# EAGLE design Payload (EAGLE 9.6.2)

## Sheet 1 of 2
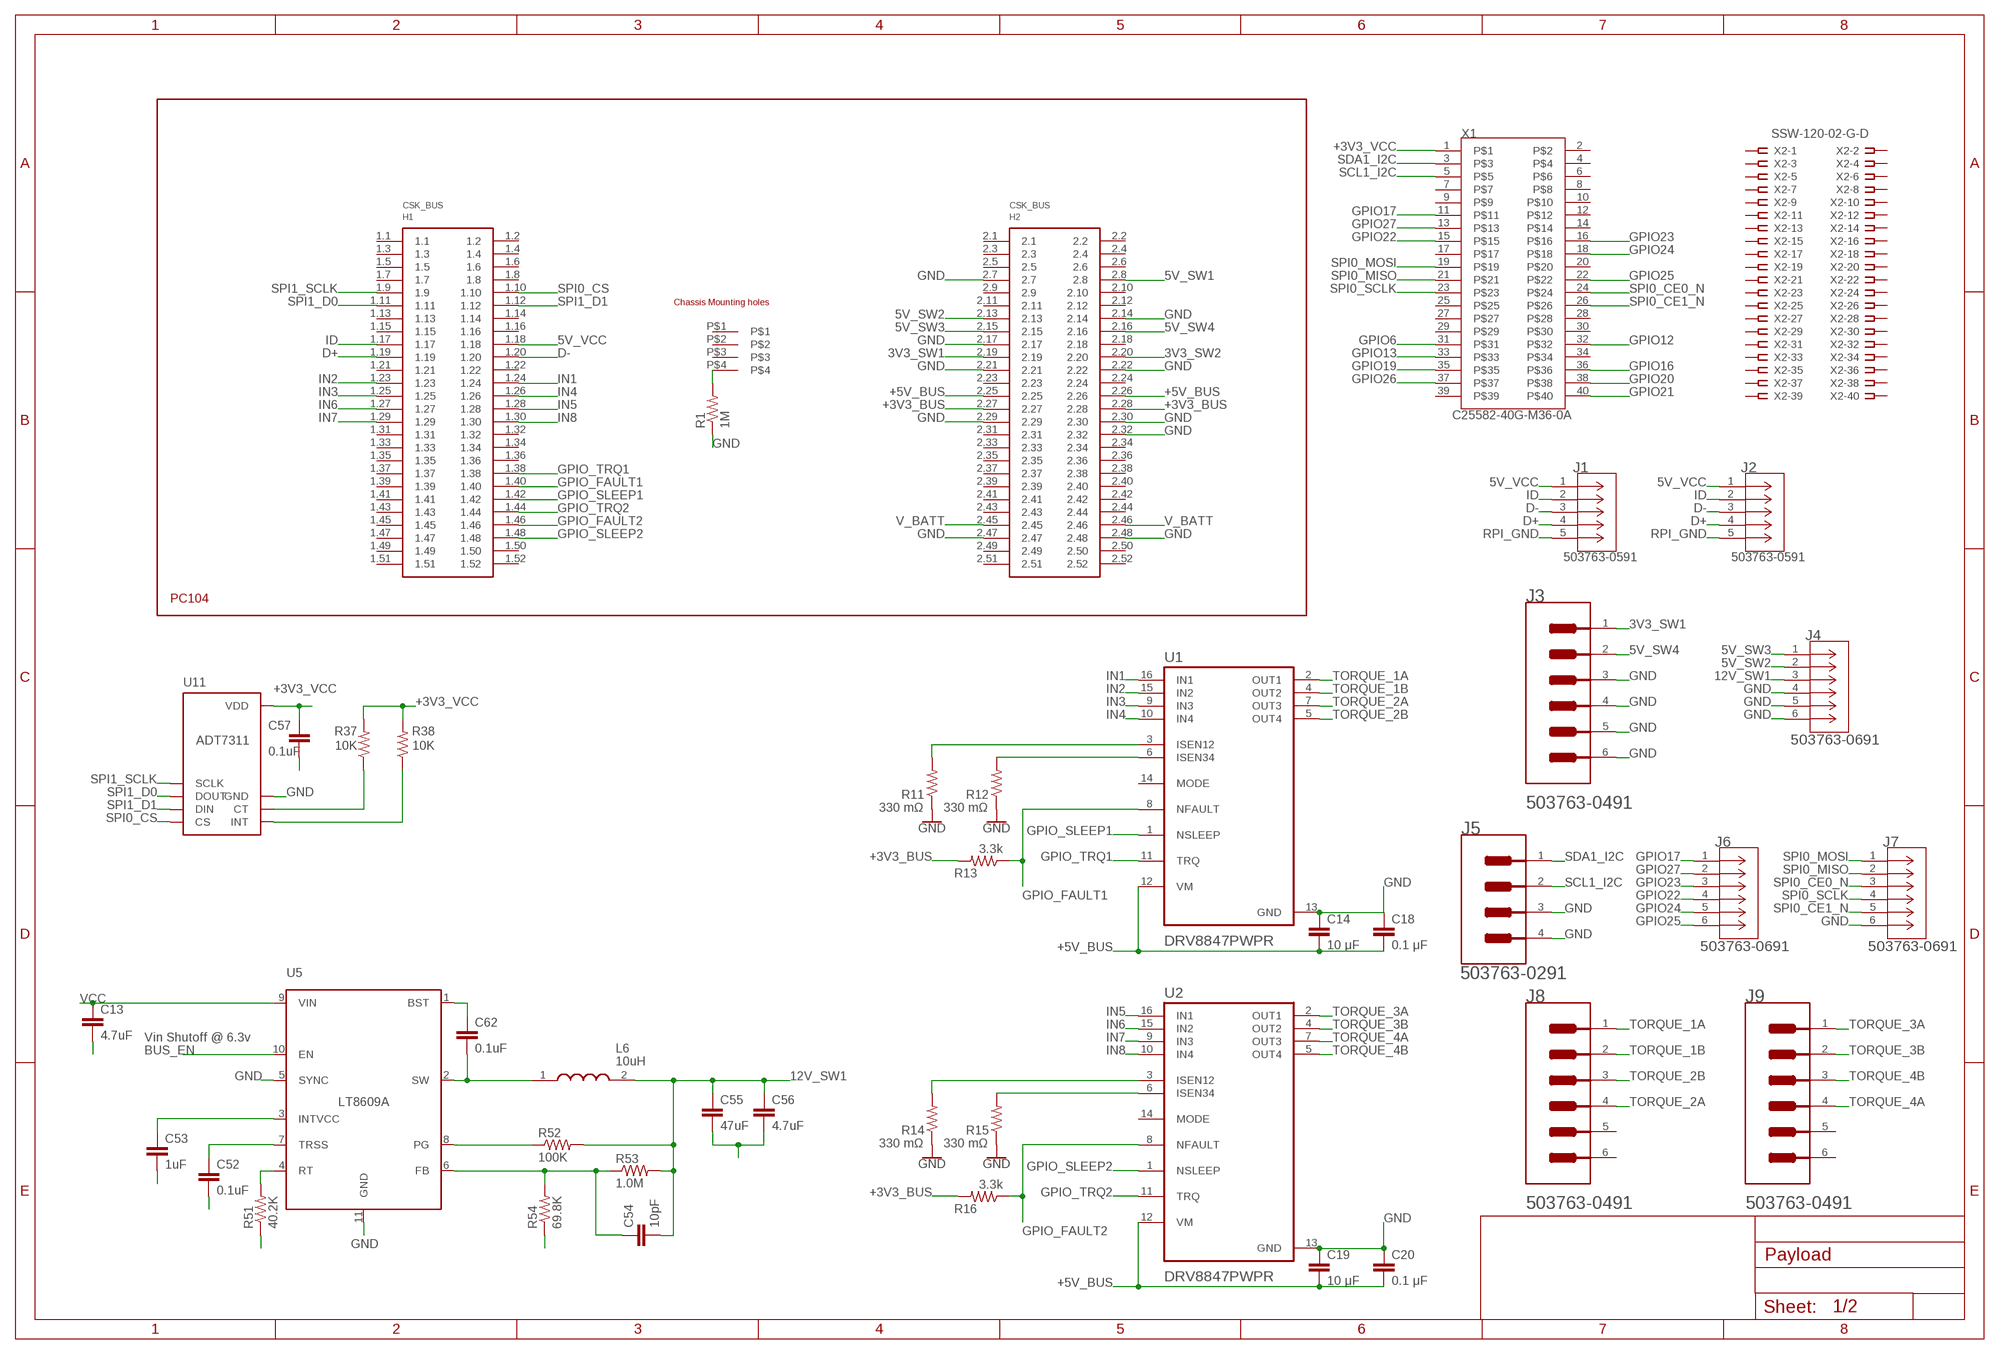
[diagram p0: schematic, sheet 1]

### Parts
C13  4.7uF  CAP0805  [0805]
C14  10 μF  CAP0805  [0805]
C18  0.1 μF  CAP0805  [0805]
C19  10 μF  CAP0805  [0805]
C20  0.1 μF  CAP0805  [0805]
C52  0.1uF  CAP0805  [0805]
C53  1uF  CAP0805  [0805]
C54  10pF  CAP0805  [0805]
C55  47uF  CAP1210  [1210]
C56  4.7uF  CAP0805  [0805]
C57  0.1uF  CAP0805  [0805]
C62  0.1uF  CAP0805  [0805]
H1  PC104_WCONN  [PC104_WCONN]
J1  503763-0591  [CONN_5037630591_MOL]
J2  503763-0591  [CONN_5037630591_MOL]
J3  MOLEX_503763-0491MOLEX_503763-0491_0_0  [MOLEX_503763-0491_0]
J4  503763-0691  [CONN_503763-0691_MOL]
J5  MOLEX_503763-0291MOLEX_503763-0291_0_0  [MOLEX_503763-0291_0]
J6  503763-0691  [CONN_503763-0691_MOL]
J7  503763-0691  [CONN_503763-0691_MOL]
J8  MOLEX_503763-0491MOLEX_503763-0491_0_0  [MOLEX_503763-0491_0]
J9  MOLEX_503763-0491MOLEX_503763-0491_0_0  [MOLEX_503763-0491_0]
L6  10uH  XFL4020-222MEC  [XFL4030472MEB]
R1  1M  RESISTOR0805-RES  [0805]
R11  330 mΩ  RESISTOR0805-RES  [0805]
R12  330 mΩ  RESISTOR0805-RES  [0805]
R13  3.3k  RESISTOR0805-RES  [0805]
R14  330 mΩ  RESISTOR0805-RES  [0805]
R15  330 mΩ  RESISTOR0805-RES  [0805]
R16  3.3k  RESISTOR0805-RES  [0805]
R37  10K  RESISTOR0805-RES  [0805]
R38  10K  RESISTOR0805-RES  [0805]
R51  40.2K  RESISTOR0805-RES  [0805]
R52  100K  RESISTOR0805-RES  [0805]
R53  1.0M  RESISTOR0805-RES  [0805]
R54  69.8K  RESISTOR0805-RES  [0805]
U1  DRV8847PWPR  [SOP65P640X120-17N]
U2  DRV8847PWPR  [SOP65P640X120-17N]
U5  LT8609A  [MSOP-10_MSE]
U11  ADT7311  [SOIC-8]
X1  C25582-40G-M36-0A  [ADAFRUIT_C25582-40G-M36-0A_0]
X2  SSW-120-02-G-D  [SSW-120-02-G-D]

### Nets
3V3_SW1: H1.2.19 J3.1
3V3_SW2: H1.2.20
5V_SW1: H1.2.8
5V_SW2: H1.2.13 J4.2
5V_SW3: H1.2.15 J4.1
5V_SW4: H1.2.16 J3.2
5V_VCC: H1.1.18 J1.1 J2.1
12V_SW1: C54.2 C55.1 C56.1 J4.3 L6.2 R52.2 R53.2
+3V3_BUS: H1.2.27 H1.2.28 R13.2 R16.2
+3V3_VCC: C57.1 R37.2 R38.2 U11.8(VDD) X1.1
+5V_BUS: C14.2 C18.2 C19.2 C20.2 H1.2.25 H1.2.26 U1.12(VM) U2.12(VM)
BST_3V3_BUS: C62.1 U5.1(BST)
BUS_EN: U5.10(EN)
D+: H1.1.19 J1.4 J2.4
D-: H1.1.20 J1.3 J2.3
FB_3V3_BUS: C54.1 R53.1 R54.2 U5.6(FB)
GND: C14.1 C18.1 C19.1 C20.1 C52.2 C53.2 C55.2 C56.2 C57.2 H1.2.7 H1.2.14 H1.2.17 H1.2.21 H1.2.22 H1.2.29 H1.2.30 H1.2.32 H1.2.47 H1.2.48 J3.3 J3.4 J3.5(MNT_1) J3.6(MNT_2) J4.4 J4.5 J4.6 J5.3(MNT_1) J5.4(MNT_2) J7.6 R1.1 R11.1 R12.1 R14.1 R15.1 R51.1 R54.1 U1.13(GND) U2.13(GND) U5.5(SYNC) U5.11(GND) U11.7(GND) ; also sheet 2
GND1: C13.2
GPIO6: X1.31
GPIO12: X1.32
GPIO13: X1.33
GPIO16: X1.36
GPIO17: J6.1 X1.11
GPIO19: X1.35
GPIO20: X1.38
GPIO21: X1.40
GPIO22: J6.4 X1.15
GPIO23: J6.3 X1.16
GPIO24: J6.5 X1.18
GPIO25: J6.6 X1.22
GPIO26: X1.37
GPIO27: J6.2 X1.13
GPIO_FAULT1: H1.1.40 R13.1 U1.8(NFAULT)
GPIO_FAULT2: H1.1.46 R16.1 U2.8(NFAULT)
GPIO_SLEEP1: H1.1.42 U1.1(NSLEEP)
GPIO_SLEEP2: H1.1.48 U2.1(NSLEEP)
GPIO_TRQ1: H1.1.38 U1.11(TRQ)
GPIO_TRQ2: H1.1.44 U2.11(TRQ)
ID: H1.1.17 J1.2 J2.2
IN1: H1.1.24 U1.16(IN1)
IN2: H1.1.23 U1.15(IN2)
IN3: H1.1.25 U1.9(IN3)
IN4: H1.1.26 U1.10(IN4)
IN5: H1.1.28 U2.16(IN1)
IN6: H1.1.27 U2.15(IN2)
IN7: H1.1.29 U2.9(IN3)
IN8: H1.1.30 U2.10(IN4)
N$9: H1.P$4 R1.2
N$16: R12.2 U1.6(ISEN34)
N$18: R11.2 U1.3(ISEN12)
N$20: R15.2 U2.6(ISEN34)
N$21: R14.2 U2.3(ISEN12)
PG_3V3_BUS: R52.1 U5.8(PG)
RPI_GND: J1.5 J2.5
RT_3V3_BUS: R51.2 U5.4(RT)
SCL1_I2C: J5.2 X1.5
SDA1_I2C: J5.1 X1.3
SPI0_CE0_N: J7.3 X1.24
SPI0_CE1_N: J7.5 X1.26
SPI0_CS: H1.1.10 U11.4(CS)
SPI0_MISO: J7.2 X1.21
SPI0_MOSI: J7.1 X1.19
SPI0_SCLK: J7.4 X1.23
SPI1_D0: H1.1.11 U11.2(DOUT)
SPI1_D1: H1.1.12 U11.3(DIN)
SPI1_SCLK: H1.1.9 U11.1(SCLK)
SW_3V3_BUS: C62.2 L6.1 U5.2(SW)
TORQUE_1A: J8.1 U1.2(OUT1)
TORQUE_1B: J8.2 U1.4(OUT2)
TORQUE_2A: J8.4 U1.7(OUT3)
TORQUE_2B: J8.3 U1.5(OUT4)
TORQUE_3A: J9.1 U2.2(OUT1)
TORQUE_3B: J9.2 U2.4(OUT2)
TORQUE_4A: J9.4 U2.7(OUT3)
TORQUE_4B: J9.3 U2.5(OUT4)
TRSS_3V3_BUS: C52.1 U5.7(TRSS)
U11_CT: R37.1 U11.6(CT)
U11_INT: R38.1 U11.5(INT)
V_BATT: H1.2.45 H1.2.46 ; also sheet 2
VCC: C13.1 U5.9(VIN) ; also sheet 2
VCC_3V3_BUS: C53.1 U5.3(INTVCC)
Unconnected: H1.1.1 H1.1.2 H1.1.3 H1.1.4 H1.1.5 H1.1.6 H1.1.7 H1.1.8 H1.1.13 H1.1.14 H1.1.15 H1.1.16 H1.1.21 H1.1.22 H1.1.31 H1.1.32 H1.1.33 H1.1.34 H1.1.35 H1.1.36 H1.1.37 H1.1.39 H1.1.41 H1.1.43 H1.1.45 H1.1.47 H1.1.49 H1.1.50 H1.1.51 H1.1.52 H1.2.1 H1.2.2 H1.2.3 H1.2.4 H1.2.5 H1.2.6 H1.2.9 H1.2.10 H1.2.11 H1.2.12 H1.2.18 H1.2.23 H1.2.24 H1.2.31 H1.2.33 H1.2.34 H1.2.35 H1.2.36 H1.2.37 H1.2.38 H1.2.39 H1.2.40 H1.2.41 H1.2.42 H1.2.43 H1.2.44 H1.2.49 H1.2.50 H1.2.51 H1.2.52 H1.P$1 H1.P$2 H1.P$3 J8.5(MNT_1) J8.6(MNT_2) J9.5(MNT_1) J9.6(MNT_2) U1.14(MODE) U2.14(MODE) X1.2 X1.4 X1.6 X1.7 X1.8 X1.9 X1.10 X1.12 X1.14 X1.17 X1.20 X1.25 X1.27 X1.28 X1.29 X1.30 X1.34 X1.39 X2.1 X2.2 X2.3 X2.4 X2.5 X2.6 X2.7 X2.8 X2.9 X2.10 X2.11 X2.12 X2.13 X2.14 X2.15 X2.16 X2.17 X2.18 X2.19 X2.20 X2.21 X2.22 X2.23 X2.24 X2.25 X2.26 X2.27 X2.28 X2.29 X2.30 X2.31 X2.32 X2.33 X2.34 X2.35 X2.36 X2.37 X2.38 X2.39 X2.40

### Notes on the sheet
- Vin Shutoff @ 6.3v

## Sheet 2 of 2
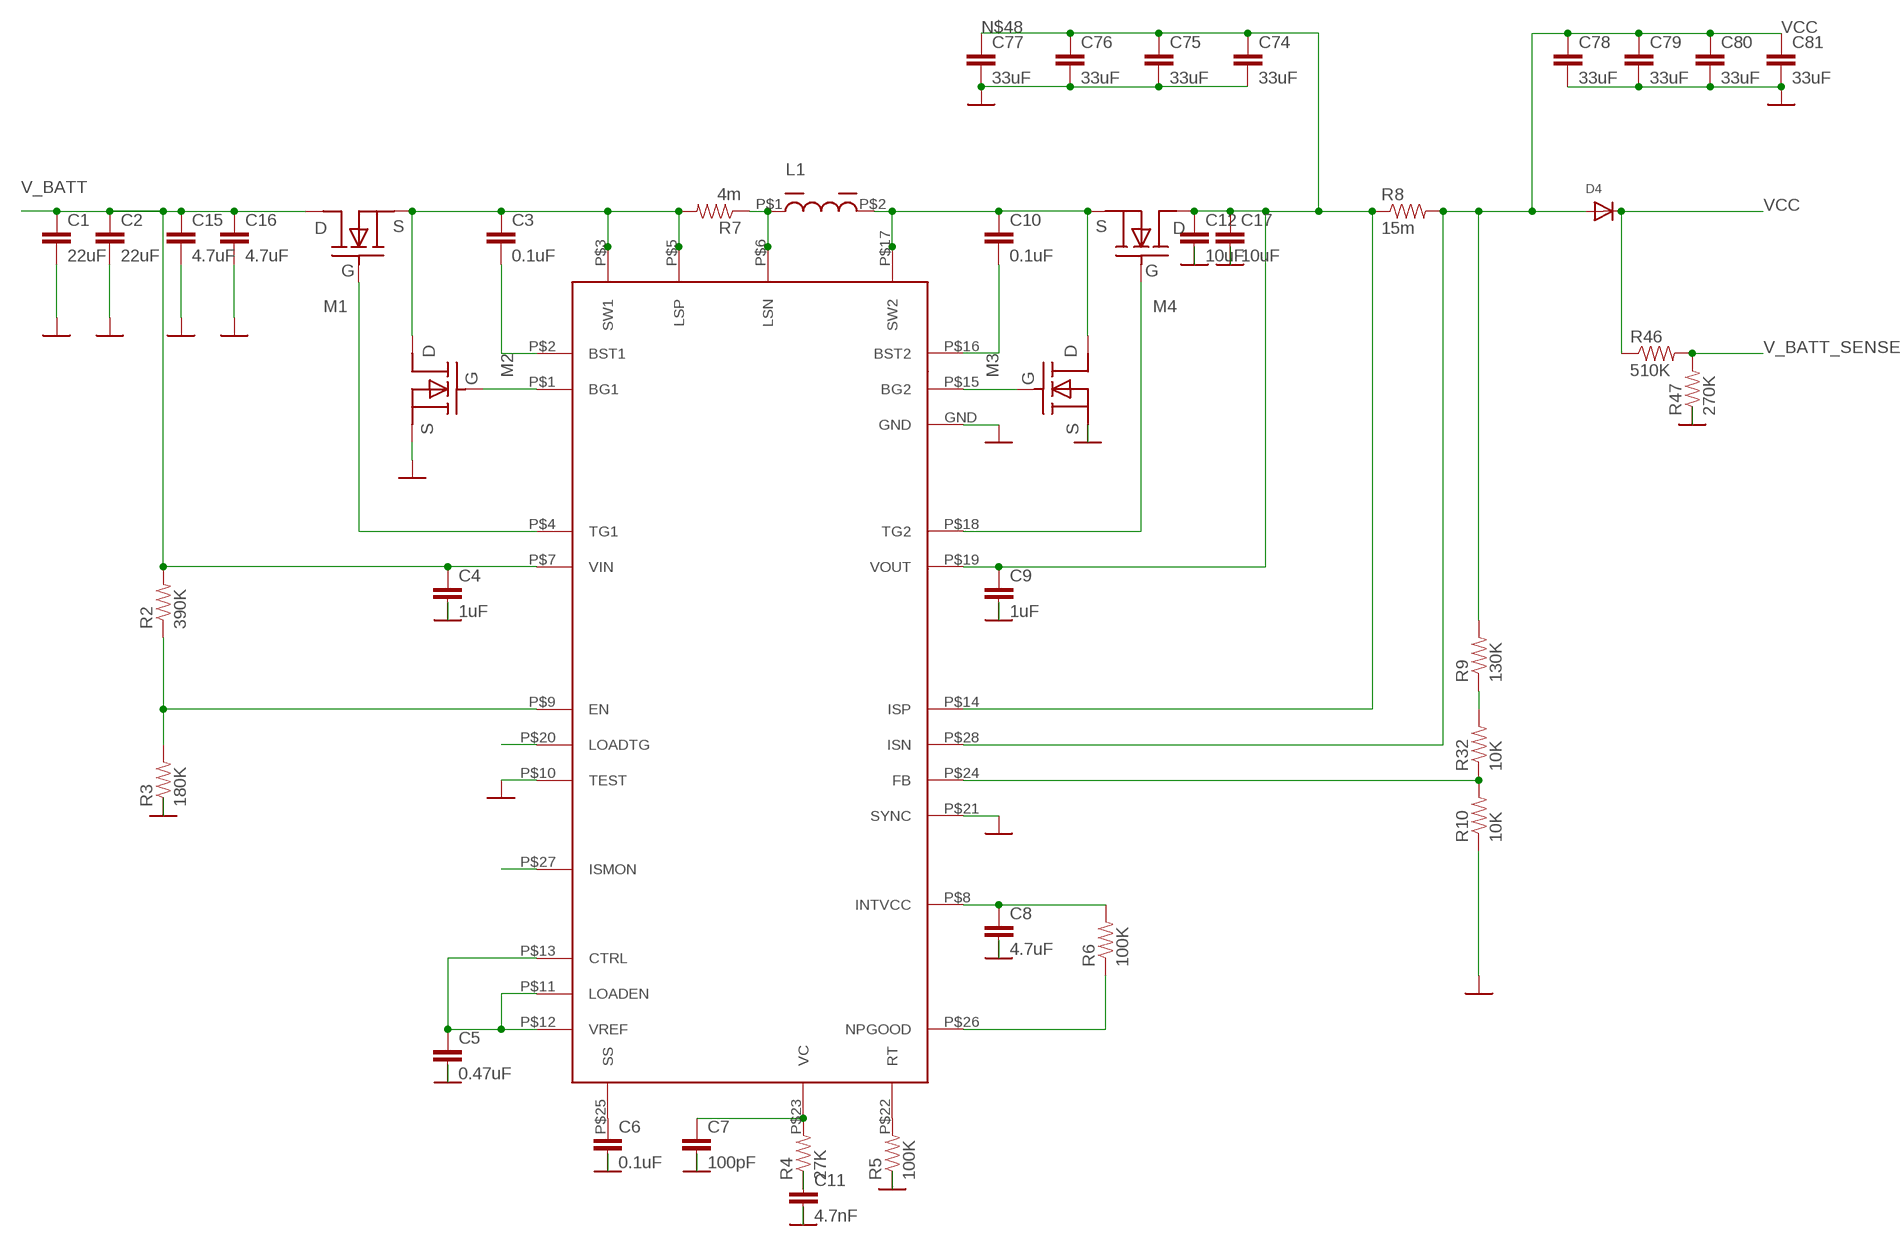
[diagram p1: schematic, sheet 2]

### Parts
C1  22uF  CAP0805  [0805]
C2  22uF  CAP0805  [0805]
C3  0.1uF  CAP0805  [0805]
C4  1uF  CAP0805  [0805]
C5  0.47uF  CAP0805  [0805]
C6  0.1uF  CAP0805  [0805]
C7  100pF  CAP0805  [0805]
C8  4.7uF  CAP0805  [0805]
C9  1uF  CAP0805  [0805]
C10  0.1uF  CAP0805  [0805]
C11  4.7nF  CAP0805  [0805]
C12  10uF  CAP0805  [0805]
C15  4.7uF  CAP0805  [0805]
C16  4.7uF  CAP0805  [0805]
C17  10uF  CAP0805  [0805]
C74  33uF  CAP1206  [1206]
C75  33uF  CAP1206  [1206]
C76  33uF  CAP1206  [1206]
C77  33uF  CAP1206  [1206]
C78  33uF  CAP1206  [1206]
C79  33uF  CAP1206  [1206]
C80  33uF  CAP1206  [1206]
C81  33uF  CAP1206  [1206]
D4  DIODE_SOD-123FL  [SOD-123FL]
L1  6uH  7443551600  [7443551600]
M1  BSZ100N06LS3  [BSZ100N06LS3]
M2  BSZ100N06LS3  [BSZ100N06LS3]
M3  BSZ033NE2LS5  BSZ100N06LS3  [BSZ100N06LS3]
M4  BSZ033NE2LS5  BSZ100N06LS3  [BSZ100N06LS3]
R2  390K  RESISTOR0805-RES  [0805]
R3  180K  RESISTOR0805-RES  [0805]
R4  27K  RESISTOR0805-RES  [0805]
R5  100K  RESISTOR0805-RES  [0805]
R6  100K  RESISTOR0805-RES  [0805]
R7  4m  RESISTOR0805-RES  [0805]
R8  15m  RESISTOR0805-RES  [0805]
R9  130K  RESISTOR0805-RES  [0805]
R10  10K  RESISTOR0805-RES  [0805]
R32  10K  RESISTOR0805-RES  [0805]
R46  510K  RESISTOR0805-RES  [0805]
R47  270K  RESISTOR0805-RES  [0805]
U$2  LT8309EFE  [LT8309EFE]

### Nets
GND: C1.2 C2.2 C4.2 C5.2 C6.2 C7.2 C8.2 C9.2 C11.2 C12.2 C15.2 C16.2 C17.2 C74.2 C75.2 C76.2 C77.2 C78.2 C79.2 C80.2 C81.2 M2.P$2(S) M2.P$3(S) M2.P$4(S) M3.P$2(S) M3.P$3(S) M3.P$4(S) R3.1 R5.1 R10.1 R47.1 U$2.GND U$2.P$10(TEST) U$2.P$21(SYNC) ; also sheet 1
N$10: C3.1 M1.P$2(S) M1.P$3(S) M1.P$4(S) M2.P$5(D) M2.P$6(D) M2.P$7(D) M2.P$8(D) M2.P$9(D) R7.2 U$2.P$3(SW1) U$2.P$5(LSP)
N$11: C3.2 U$2.P$2(BST1)
N$12: C6.1 U$2.P$25(SS)
N$13: R5.2 U$2.P$22(RT)
N$14: C10.1 L1.P$2 M3.P$5(D) M3.P$6(D) M3.P$7(D) M3.P$8(D) M3.P$9(D) M4.P$2(S) M4.P$3(S) M4.P$4(S) U$2.P$17(SW2)
N$15: R9.1 R32.2
N$17: M2.P$1(G) U$2.P$1(BG1)
N$34: M1.P$1(G) U$2.P$4(TG1)
N$35: M3.P$1(G) U$2.P$15(BG2)
N$36: R2.1 R3.2 U$2.P$9(EN)
N$37: U$2.P$20(LOADTG)
N$38: U$2.P$27(ISMON)
N$39: C5.1 U$2.P$11(LOADEN) U$2.P$12(VREF) U$2.P$13(CTRL)
N$41: C7.1 R4.2 U$2.P$23(VC)
N$43: R6.1 U$2.P$26(NPGOOD)
N$44: C8.1 R6.2 U$2.P$8(INTVCC)
N$45: L1.P$1 R7.1 U$2.P$6(LSN)
N$47: C10.2 U$2.P$16(BST2)
N$48: C9.1 C12.1 C17.1 C74.1 C75.1 C76.1 C77.1 M4.P$5(D) M4.P$6(D) M4.P$7(D) M4.P$8(D) M4.P$9(D) R8.1 U$2.P$14(ISP) U$2.P$19(VOUT)
N$49: M4.P$1(G) U$2.P$18(TG2)
N$51: R10.2 R32.1 U$2.P$24(FB)
N$55: C11.1 R4.1
V_BATT: C1.1 C2.1 C4.1 C15.1 C16.1 M1.P$5(D) M1.P$6(D) M1.P$7(D) M1.P$8(D) M1.P$9(D) R2.2 U$2.P$7(VIN) ; also sheet 1
V_BATT_SENSE: R46.2 R47.2
VCC: C78.1 C79.1 C80.1 C81.1 D4.A D4.C R8.2 R9.2 R46.1 U$2.P$28(ISN) ; also sheet 1

## Library data of the parts
C1-C20 C52-C57 C62 C74-C81 = HSFL_Main_Library:CAP: Capacitor Standard 0603 ceramic capacitor, and 0.1" leaded capacitor.
D4 = adafruit:DIODE: Diode SMADIODE - SMA Surface Mount Package 20V 1A Schottky Diode Digikey: 641-1014-6-ND DO-1N4148 - Through Hole Small Current Diode SOD-123 20V 1 A (.5mV Vf) Schottky Diode - Digikey: MBRX120TPMSCT-ND SOD-323 10V 570mA (.38mV Vf, 3ns) Schottky Diode - Digikey: ZLLS410CT-ND SOD-523 30V 30mA Schottky Diode (RB751S-40TE61) - Digikey: RB751S-40TE61CT-ND SOT23-R/W - SOT23 Package (R = Solder Paste/Reflow Ovens, W = Hand-Soldering) BAT54Film 40V 300mA - Digikey: 497-7162-1-ND
H1 = HSFL_Main_Library:PC104_WCONN
J1 J2 = Molex - 503763-0591:503763-0591; BUILT_BY: EMA_Cory; COPYRIGHT: Copyright (C) 2018 Accelerated Designs. All rights reserved; DATASHEET: https://www.molex.com/pdm_docs/sd/5037630591_sd.pdf; MANUFACTURER_PART_NUMBER: 503763-0591; SOURCELIBRARY: Add_to_database_2020-12-14; VENDOR: Molex Connector Corporation
J3 J8 J9 = Molex - 503763-0491:MOLEX_503763-0491: Wire-To-Board Connector, Pico-Lock 503763 Series, Surface Mount, Header, 4 Contacts, 1 mm; AUTOMOTIVE: No; CENTROID_NOT_SPECIFIED: No; CONN_GENDER: Male; CONN_ORIENTATION: Right Angle; CONTACT_MATERIAL: Gold,Nickel; CURRENT_RATING: 1.5A; DATASHEET: https://www.molex.com/webdocs/datasheets/pdf/en-us/5037630491_PCB_HEADERS.pdf; DEVICE_CLASS_L1: Connectors; DEVICE_CLASS_L2: Headers and Wire Housings; DEVICE_CLASS_L3: unset; DIGIKEY_DESCRIPTION: CONN HEADER 1MM R/A 4CKT; DIGIKEY_PART_NUMBER: WM10655CT-ND; FOOTPRINT_URL: https://www.molex.com/pdm_docs/sd/5037630491_sd.pdf; FOOTPRINT_VARIANT_NAME_0: Recommended_Land_Pattern; HEIGHT: 1.7mm; LEAD_FREE: Yes; MF: Molex; MFG_PACKAGE_IDENT: 503763-0491; MFG_PACKAGE_IDENT_DATE: 0; MFG_PACKAGE_IDENT_REV: 0; MOUSER_PART_NUMBER: 538-503763-0491; MPN: 503763-0491; NUMBER_OF_CONTACTS: 4; NUMBER_OF_ROWS: 1; PACKAGE: HDR4; PITCH: 1mm; PREFIX: J; ROHS: Yes; TEMPERATURE_RANGE_HIGH: +105°C; TEMPERATURE_RANGE_LOW: -40°C; VERIFICATION_VERSION: 0.0.0.1; VOLTAGE_RATING: 150V
J4 J6 J7 = Molex - 503763-0691:503763-0691; BUILT_BY: EMA_Cory; COPYRIGHT: Copyright (C) 2018 Accelerated Designs. All rights reserved; DATASHEET: https://www.digikey.com/products/en?keywords=503763-0691; MANUFACTURER_PART_NUMBER: 503763-0691; SOURCELIBRARY: Molex_2020-01-22; VENDOR: Molex Connector Corporation
J5 = Molex - 503763-0291:MOLEX_503763-0291: 2 Positions Header Connector 0.039" (1.00mm) Surface Mount, Right Angle Gold; CENTROID_NOT_SPECIFIED: No; DATASHEET: http://www.molex.com/pdm_docs/sd/5037630291_sd.pdf; DIGIKEY_DESCRIPTION: CONN HEADER 1MM R/A 2CKT; DIGIKEY_PART_NUMBER: WM10654CT-ND; LEAD_FREE: yes; MF: Molex; MOUSER_PART_NUMBER: 538-503763-0291; MPN: 503763-0291; PACKAGE: HDR02; PREFIX: J; ROHS: yes; TEMPERATURE_RANGE_HIGH: +105°C; TEMPERATURE_RANGE_LOW: -40°C
L1 = HSFL_Main_Library:7443551600
L6 = HSFL_Main_Library:XFL4020-222MEC: COILCRAFT - XFL4020-222MEC - INDUCTOR, 2.2UH, 8A, 20%, PWR, 38MHZ Source: Datasheet <https://www.coilcraft.com/pdfs/xfl4020.pdf>; ARROW_PART_NUMBER: XFL4020-222MEC; DESCRIPTION: COILCRAFT - XFL4020-222MEC - INDUCTOR, 2.2UH, 8A, 20%, PWR, 38MHZ; HEIGHT: 3mm; MANUFACTURER_NAME: COILCRAFT; MANUFACTURER_PART_NUMBER: XFL4020-222MEC; MOUSER_PART_NUMBER: 994-XFL4020-222MEC; MOUSER_PRICE-STOCK: https://www.mouser.co.uk/ProductDetail/Coilcraft/XFL4020-222MEC?qs=zCSbvcPd3pbe5jEAG1ZkEA%3D%3D
M1-M4 = HSFL_Main_Library:BSZ100N06LS3
R1-R16 R32 R37 R38 R46 R47 R51-R54 = HSFL_Main_Library:RESISTOR: Resistor Basic schematic elements and footprints for 0603, 1206, and PTH resistors.
U1 U2 = DRV8847PWPR:DRV8847PWPR: None Check prices <https://pricing.snapeda.com/parts/DRV8847PWPR/Texas%20Instruments/view-part?ref=eda>; AVAILABILITY: Warning; DESCRIPTION: 18-V, 2-A dual H-bridge motor driver with current regulation & independent half-bridge control 16-HTSSOP -40 to 125; MF: Texas Instruments; MP: DRV8847PWPR; PACKAGE: HTSSOP-16 Texas Instruments; PRICE: None; PURCHASE-URL: https://pricing.snapeda.com/search/part/DRV8847PWPR/?ref=eda
U5 = HSFL_Main_Library:LT8609A
U11 = HSFL_Main_Library:ADT7311: The ADT7311 is a high accuracy digital temperature sensor in a narrow 8-lead SOIC package. It contains a band gap temperature reference and a 16-bit ADC to monitor and digitize the temperature to a 0.0078°C resolution. The ADC resolution, by default, is set to 13 bits (0.0625°C). The ADC resolution is a user programmable mode that can be changed through the serial interface. br> The ADT7311 is guaranteed to operate over supply voltages from 2.7 V to 5.5 V. Operating at 3.3 V, the average supply current is typically 210 μA. The ADT7311 has a shutdown mode that powers down the device and offers a shutdown current of typically 2 μA. The ADT7311 is rated for operation over the −40°C to +150°C temperature range. br> The CT pin is an open-drain output that becomes active when the temperature exceeds a programmable critical temperature limit. The default critical temperature limit is 147°C. The INT pin is also an open-drain output that becomes active when the temperature exceeds a programmable limit. The INT and CT pins can operate in either comparator or interrupt mode.
U$2 = Personal:LT8309EFE
X1 = Adafruit - C25582-40G-M36-0A:C25582-40G-M36-0A
X2 = con-samtec:SSW-120-02-G: THROUGH-HOLE .025" SQ POST SOCKET Source: Samtec SSW.pdf; MF: Samtec Inc.; MPN: SSW-120-02-G-D; OC_FARNELL: unknown; OC_NEWARK: 11P9639

## Board
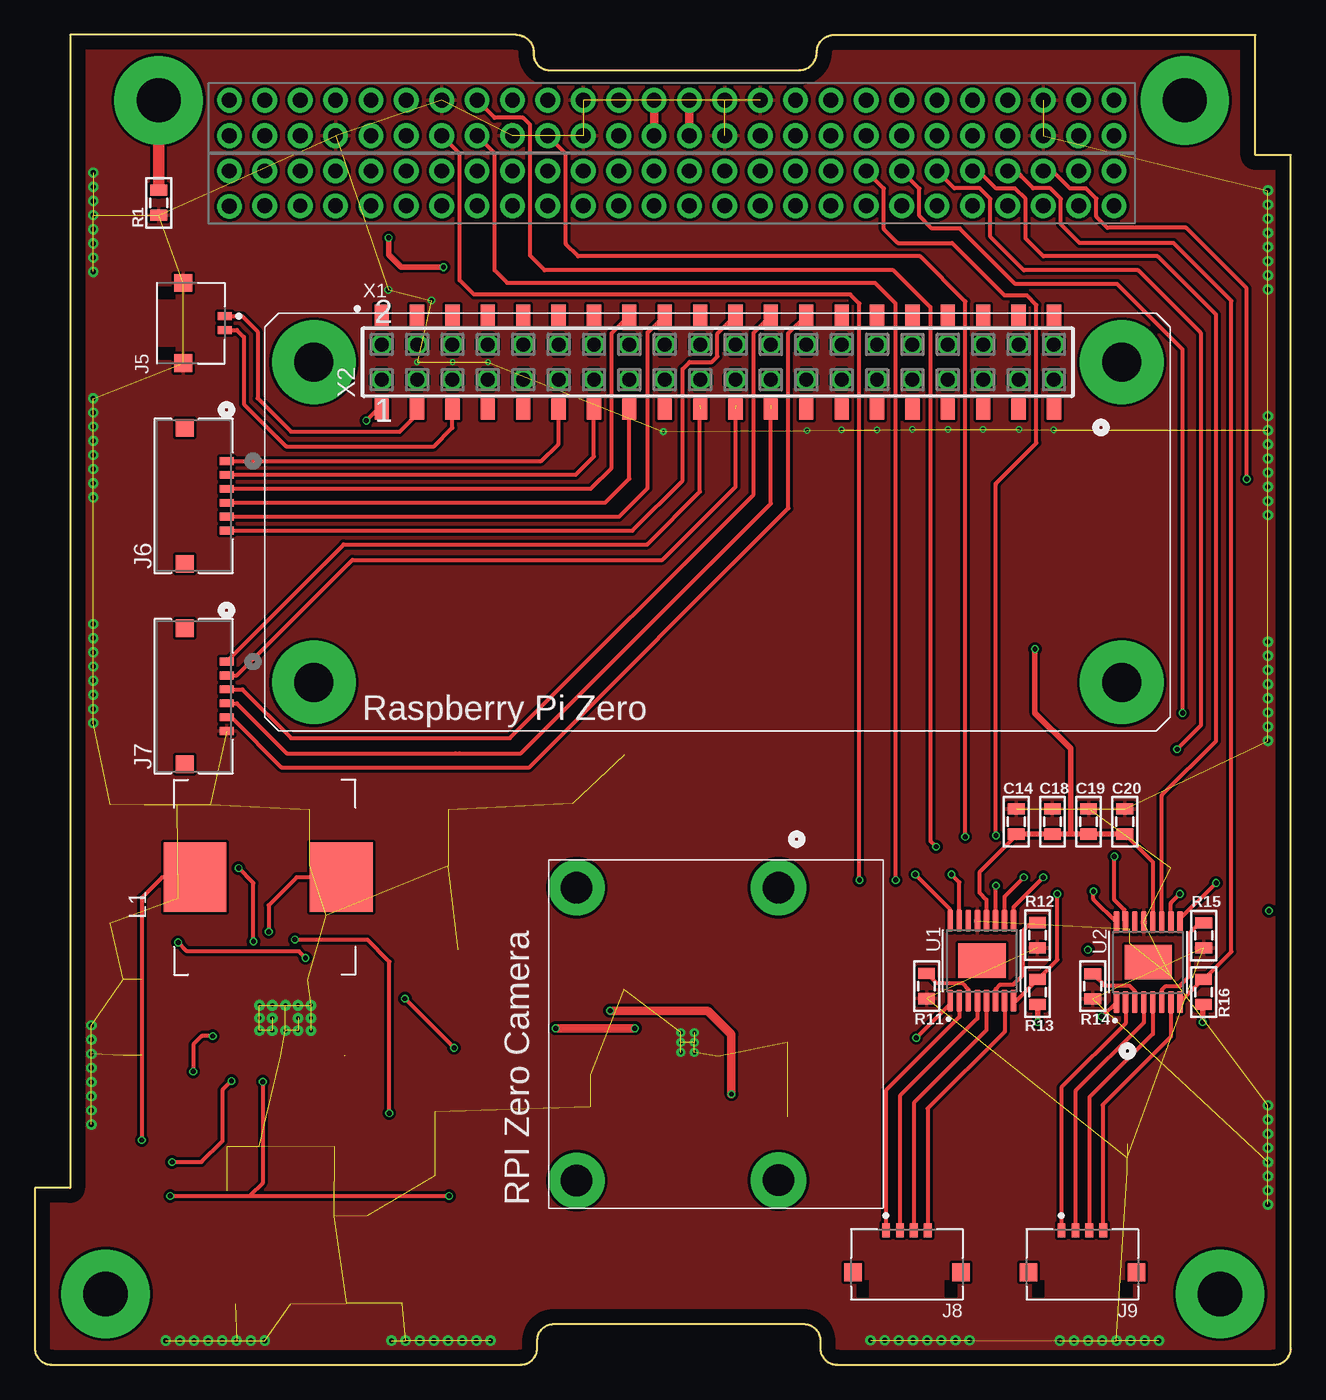
[diagram p2: board, top side]
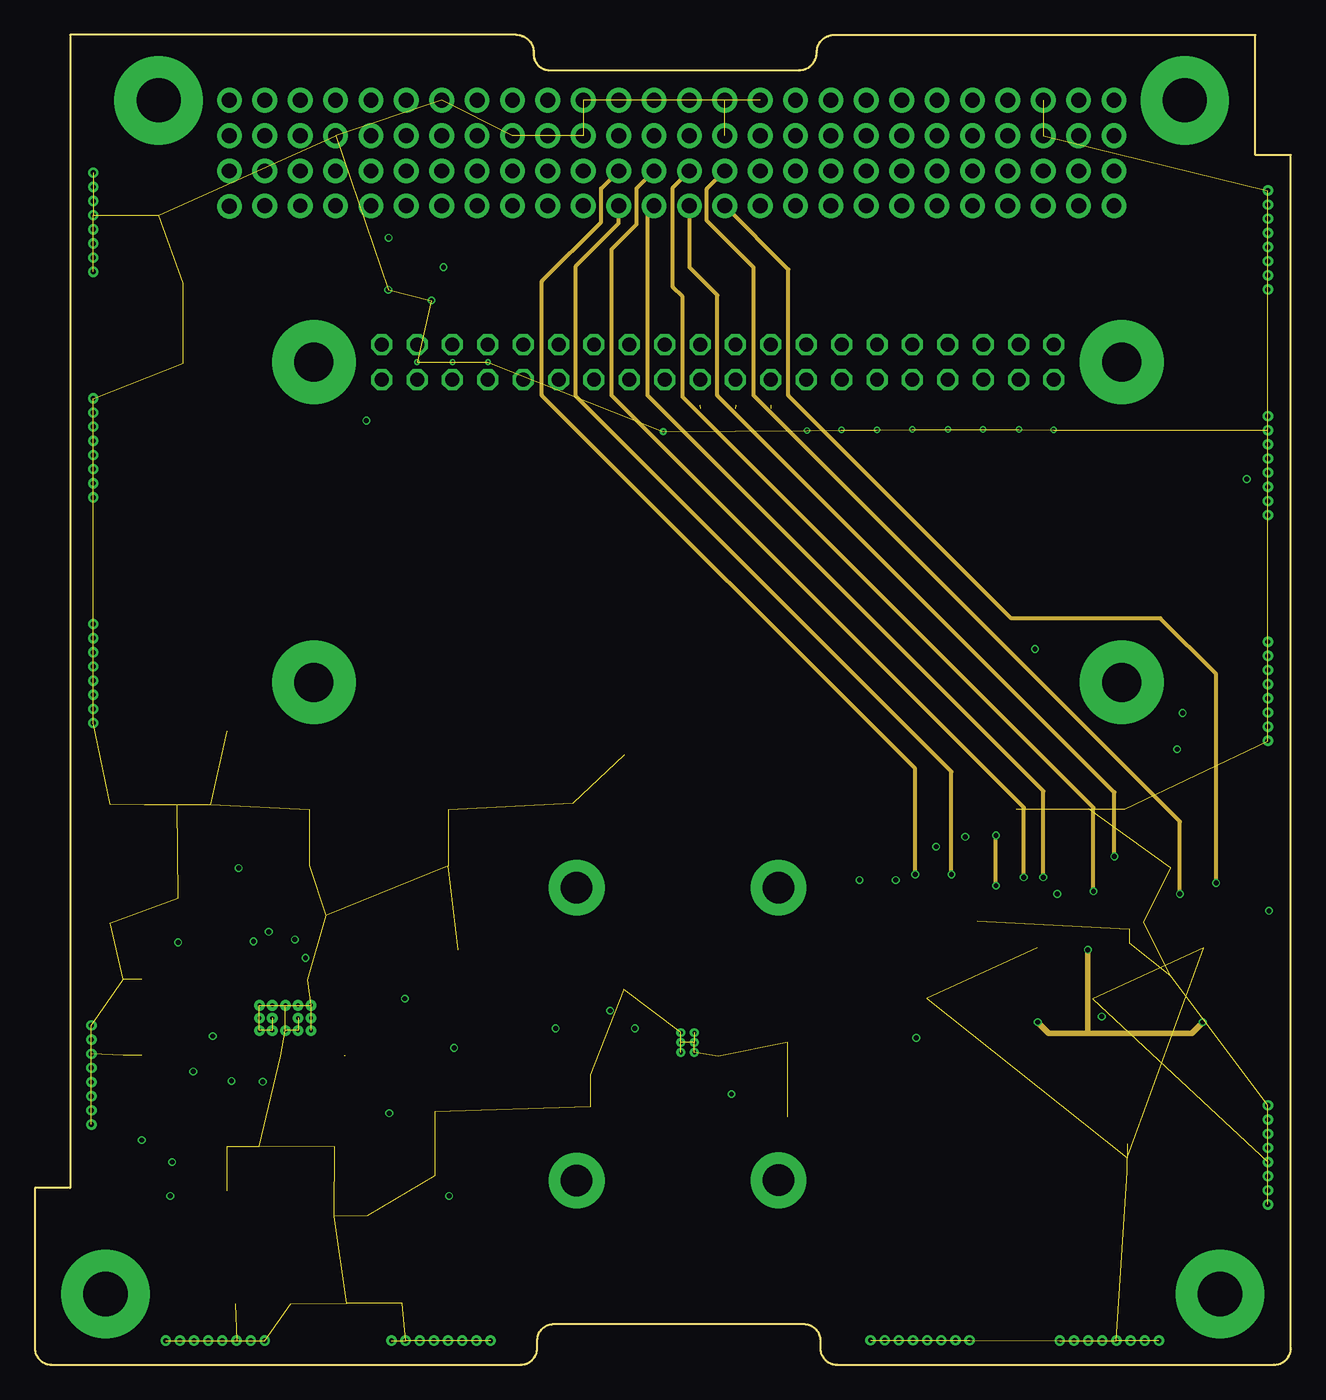
[diagram p3: board, inner layer Route2]
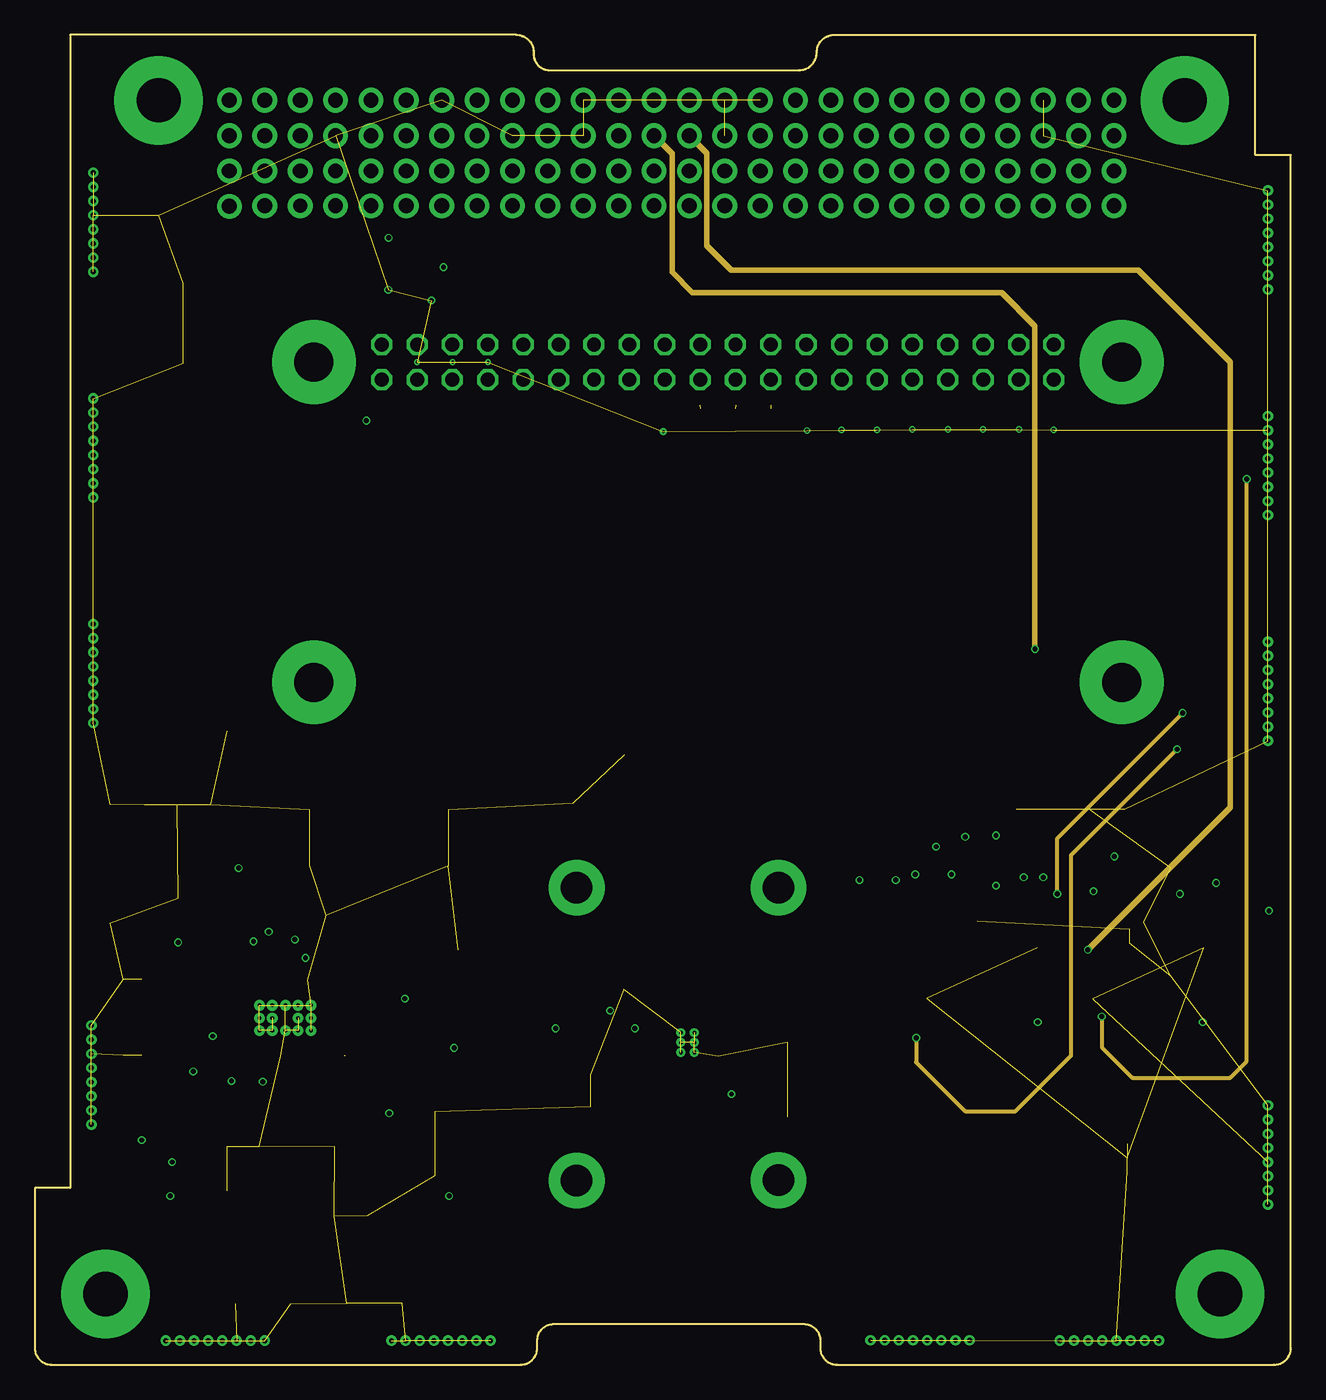
[diagram p4: board, inner layer Route15]
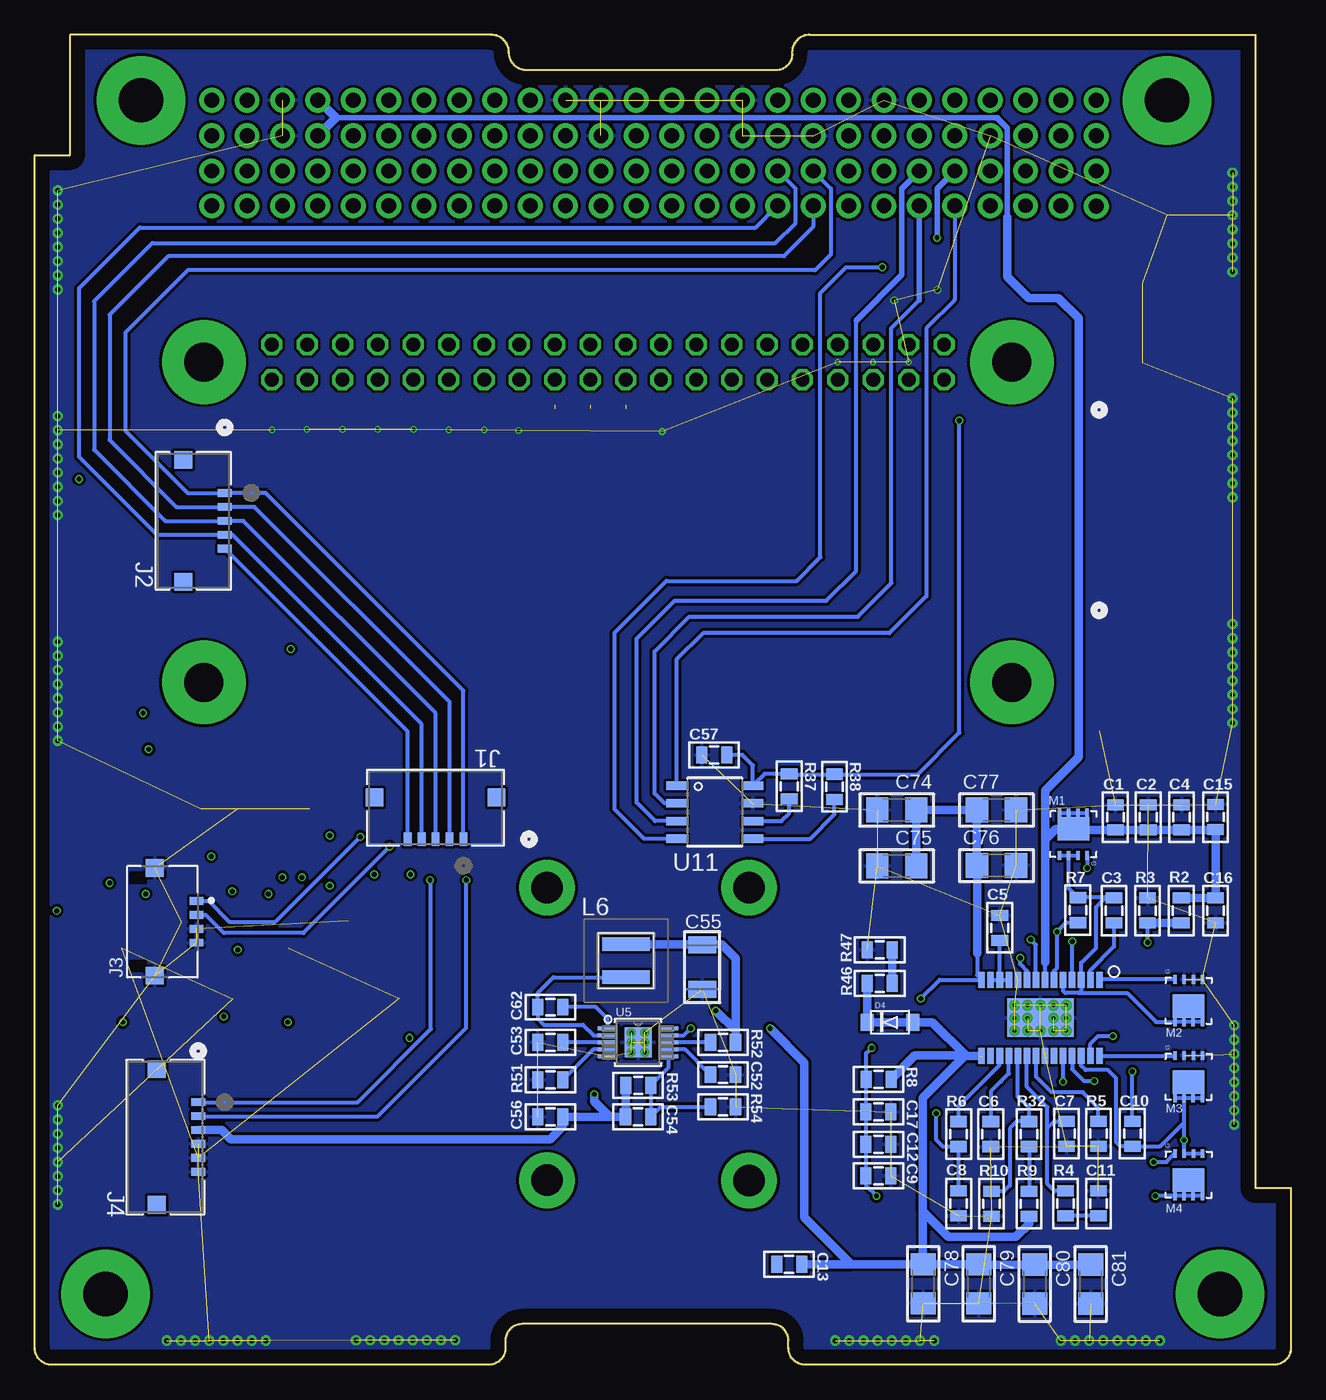
[diagram p5: board, bottom side, seen from below]

Size 90.17 x 95.5 mm. Coordinates in mm from the lower left corner, seen from the top.
Copper layers (1+2*15+16): Top 0.035mm / dielectric 1.5mm / Route2 0.035mm / dielectric 0.15mm / Route15 0.035mm / dielectric 0.2mm / Bottom 0.035mm
Design rules "default *": minimum track width 6mil, minimum drill 8mil, track to track 0.2mm, track to pad 0.2mm, pad to pad 6mil, via to via 0.2mm, smd to smd 6mil, copper to edge 40mil, drill to drill 6mil, minimum pad ring 10mil, minimum via ring 4mil, stop-mask expansion 0mil, vias tented up to drill 0mil, thermal gap 8mil

### Footprints (pad centres in the part's own frame; a part is rotated, then mirrored left to right if it is on the bottom)
0805 = smd 0.8 x 1.2: 1 -0.9,0; 2 0.9,0
1210 = smd 1.2 x 2: 1 -1.6,0; 2 1.6,0
1206 = smd 1.6 x 1.8: 1 -1.4,0; 2 1.4,0
SOD-123FL = smd 0.91 x 1.22: A 1.637,0; C -1.637,0
PC104_WCONN = drill 1.067 pad 1.778: 1.1 13.97,83.185; 1.2 13.97,85.725; 1.3 16.51,83.223; 1.4 16.51,85.725; 1.6 19.05,85.725; 1.7 21.59,83.223; 1.8 21.59,85.725; 1.9 24.13,83.223; 1.10 24.13,85.725; 1.11 26.67,83.223; 1.12 26.67,85.725; 1.13 29.21,83.223; 1.14 29.21,85.725; 1.15 31.75,83.223; 1.16 31.75,85.725; 1.17 34.29,83.223; 1.18 34.29,85.725; 1.19 36.83,83.223; 1.20 36.83,85.725; 1.21 39.37,83.223; 1.22 39.37,85.725; 1.23 41.91,83.223; 1.24 41.91,85.725; 1.25 44.45,83.223; 1.26 44.45,85.725; 1.27 46.99,83.223; 1.28 46.99,85.725; 1.29 49.53,83.223; 1.30 49.53,85.725; 1.31 52.07,83.223; 1.32 52.07,85.725; 1.33 54.61,83.223; 1.34 54.61,85.725; 1.35 57.15,83.223; 1.36 57.15,85.725; 1.37 59.69,83.223; 1.38 59.69,85.725; 1.39 62.23,83.223; 1.40 62.23,85.725; 1.41 64.77,83.223; 1.42 64.77,85.725; 1.43 67.31,83.223; 1.44 67.31,85.725; 1.45 69.85,83.223; 1.46 69.85,85.725; 1.47 72.39,83.223; 1.48 72.39,85.725; 1.49 74.93,83.223; 1.50 74.93,85.725; 1.51 77.47,83.223; 1.52 77.47,85.725; 2.1 13.97,88.265; 2.2 13.97,90.805; 2.3 16.51,88.265; 2.4 16.51,90.805; 2.5 19.05,88.265; 2.6 19.05,90.805; 2.7 21.59,88.265; 2.8 21.59,90.805; 2.9 24.13,88.265; 2.10 24.13,90.805; 2.11 26.67,88.265; 2.12 26.67,90.805; 2.13 29.21,88.265; 2.14 29.21,90.805; 2.15 31.75,88.265; 2.16 31.75,90.805; 2.17 34.29,88.265; 2.18 34.29,90.805; 2.19 36.83,88.265; 2.20 36.83,90.805; 2.21 39.37,88.265; 2.22 39.37,90.805; 2.23 41.91,88.265; 2.24 41.91,90.805; 2.25 44.45,88.265; 2.26 44.45,90.805; 2.27 46.99,88.265; 2.28 46.99,90.805; 2.29 49.53,88.265; 2.30 49.53,90.805; 2.31 52.07,88.265; 2.32 52.07,90.805; 2.33 54.61,88.265; 2.34 54.61,90.805; 2.35 57.15,88.265; 2.36 57.15,90.805; 2.37 59.69,88.265; 2.38 59.69,90.805; 2.39 62.23,88.265; 2.40 62.23,90.805; 2.41 64.77,88.265; 2.42 64.77,90.805; 2.43 67.31,88.265; 2.44 67.31,90.805; 2.45 69.85,88.265; 2.46 69.85,90.805; 2.47 72.39,88.265; 2.48 72.39,90.805; 2.49 74.93,88.265; 2.50 74.93,90.805; 2.51 77.47,88.265; 2.52 77.47,90.805 | drill 1.016 pad 1.778: 1.5 19.05,83.223 | drill 3.175 pad 6.35: P$1 5.08,5.08; P$2 85.09,5.08; P$3 82.55,90.805; P$4 8.89,90.805
CONN_5037630591_MOL = smd 0.559 x 0.991: 1 -2,2.261; 2 -1,2.261; 3 0,2.261; 4 1,2.261; 5 2,2.261 | smd 1.27 x 1.295: 6 -4.375,-0.729; 7 4.375,-0.729
MOLEX_503763-0491_0 = smd 0.55 x 1: 1 1.5,-2.435; 2 0.5,-2.435; 3 -0.5,-2.435; 4 -1.5,-2.435 | smd 1.26 x 1.3: 5 -3.875,0.555; 6 3.875,0.555
CONN_503763-0691_MOL = smd 0.559 x 0.991: 1 2.5,-2.368; 2 1.5,-2.368; 3 0.5,-2.368; 4 -0.5,-2.368; 5 -1.5,-2.368; 6 -2.5,-2.368 | smd 1.27 x 1.295: 7 -4.875,0.622; 8 4.875,0.622
MOLEX_503763-0291_0 = smd 0.55 x 1: 1 0.5,-2.435; 2 -0.5,-2.435 | smd 1.26 x 1.3: 3 -2.875,0.555; 4 2.875,0.555
7443551600 = smd 5 x 4.5: P$1 3,2; P$2 3,12.5
XFL4030472MEB = smd 0.98 x 3.4: 1 -1.185,0; 2 1.185,0
BSZ100N06LS3 = smd 0.635 x 0.254: P$1 0.127,0.66; P$2 0.127,1.321; P$3 0.127,2.007; P$4 0.127,2.642; P$5 3.175,2.642; P$6 3.175,1.981; P$7 3.175,1.321; P$8 3.175,0.66 | smd 1.702 x 2.261: P$9 2.032,1.651
SOP65P640X120-17N = smd 1.57 x 0.41: 1 -2.87,2.275; 2 -2.87,1.625; 3 -2.87,0.975; 4 -2.87,0.325; 5 -2.87,-0.325; 6 -2.87,-0.975; 7 -2.87,-1.625; 8 -2.87,-2.275; 9 2.87,-2.275; 10 2.87,-1.625; 11 2.87,-0.975; 12 2.87,-0.325; 13 2.87,0.325; 14 2.87,0.975; 15 2.87,1.625; 16 2.87,2.275 | smd 2.48 x 3.4: 17 0,0
MSOP-10_MSE = smd 1.397 x 0.279: 1 -2.184,1.001; 2 -2.184,0.5; 3 -2.184,0; 4 -2.184,-0.5; 5 -2.184,-1.001; 6 2.184,-1.001; 7 2.184,-0.5; 8 2.184,0; 9 2.184,0.5; 10 2.184,1.001 | smd 1.93 x 2.159: 11 0,0
SOIC-8 = smd 1.524 x 0.61: 1 -2.68,1.855; 2 -2.68,0.585; 3 -2.68,-0.685; 4 -2.68,-1.955; 5 2.78,-1.955; 6 2.78,-0.685; 7 2.78,0.585; 8 2.78,1.855
LT8309EFE = smd 2.75 x 4.75: GND 3.3,4.477 | smd 1.15 x 0.47: P$1 0.575,8.704; P$2 0.575,8.054; P$3 0.575,7.404; P$4 0.575,6.754; P$5 0.575,6.104; P$6 0.575,5.454; P$7 0.575,4.804; P$8 0.575,4.154; P$9 0.575,3.504; P$10 0.575,2.854; P$11 0.575,2.204; P$12 0.575,1.554; P$13 0.575,0.904; P$14 0.575,0.254; P$15 6.025,8.704; P$16 6.025,8.054; P$17 6.025,7.404; P$18 6.025,6.754; P$19 6.025,6.104; P$20 6.025,5.454; P$21 6.025,4.804; P$22 6.025,4.154; P$23 6.025,3.504; P$24 6.025,2.854; P$25 6.025,2.204; P$26 6.025,1.554; P$27 6.025,0.904; P$28 6.025,0.254
ADAFRUIT_C25582-40G-M36-0A_0 = smd 1.02 x 1.524: 1 -24.13,-3.354; 2 -24.13,3.354; 3 -21.59,-3.354; 4 -21.59,3.354; 5 -19.05,-3.354; 6 -19.05,3.354; 7 -16.51,-3.354; 8 -16.51,3.354; 9 -13.97,-3.354; 10 -13.97,3.354; 11 -11.43,-3.354; 12 -11.43,3.354; 13 -8.89,-3.354; 14 -8.89,3.354; 15 -6.35,-3.354; 16 -6.35,3.354; 17 -3.81,-3.354; 18 -3.81,3.354; 19 -1.27,-3.354; 20 -1.27,3.354; 21 1.27,-3.354; 22 1.27,3.354; 23 3.81,-3.354; 24 3.81,3.354; 25 6.35,-3.354; 26 6.35,3.354; 27 8.89,-3.354; 28 8.89,3.354; 29 11.43,-3.354; 30 11.43,3.354; 31 13.97,-3.354; 32 13.97,3.354; 33 16.51,-3.354; 34 16.51,3.354; 35 19.05,-3.354; 36 19.05,3.354; 37 21.59,-3.354; 38 21.59,3.354; 39 24.13,-3.354; 40 24.13,3.354
SSW-120-02-G-D = drill 1 pad 1.5 octagon: 1 -24.13,-1.27; 2 -24.13,1.27; 3 -21.59,-1.27; 4 -21.59,1.27; 5 -19.05,-1.27; 6 -19.05,1.27; 7 -16.51,-1.27; 8 -16.51,1.27; 9 -13.97,-1.27; 10 -13.97,1.27; 11 -11.43,-1.27; 12 -11.43,1.27; 13 -8.89,-1.27; 14 -8.89,1.27; 15 -6.35,-1.27; 16 -6.35,1.27; 17 -3.81,-1.27; 18 -3.81,1.27; 19 -1.27,-1.27; 20 -1.27,1.27; 21 1.27,-1.27; 22 1.27,1.27; 23 3.81,-1.27; 24 3.81,1.27; 25 6.35,-1.27; 26 6.35,1.27; 27 8.89,-1.27; 28 8.89,1.27; 29 11.43,-1.27; 30 11.43,1.27; 31 13.97,-1.27; 32 13.97,1.27; 33 16.51,-1.27; 34 16.51,1.27; 35 19.05,-1.27; 36 19.05,1.27; 37 21.59,-1.27; 38 21.59,1.27; 39 24.13,-1.27; 40 24.13,1.27

### Placement (x,y rotation side)
C1  12.6,39.31 90 bottom
C2  10.24,39.31 90 bottom
C3  12.7,32.61 270 bottom
C4  7.85,39.31 90 bottom
C5  20.9,31.37 90 bottom
C6  21.54,16.56 270 bottom
C7  16.1,16.59 270 bottom
C8  23.85,11.58 270 bottom
C9  29.62,13.56 0 bottom
C10  11.38,16.59 90 bottom
C11  13.82,11.58 90 bottom
C12  29.62,15.82 0 bottom
C13  36.02,7.21 180 bottom
C14  10uF  [0805]  70.45,39 270 top
C15  5.41,39.33 90 bottom
C16  5.41,32.61 270 bottom
C17  29.62,18.16 0 bottom
C18  0.1uF  [0805]  73.05,39 270 top
C19  10uF  [0805]  75.65,39 270 top
C20  0.1uF  [0805]  78.25,39 270 top
C52  40.77,20.83 0 bottom
C53  53.16,23.14 180 bottom
C54  46.86,17.81 180 bottom
C55  42.27,28.55 270 bottom
C56  53.16,17.81 180 bottom
C57  41.4,43.79 180 bottom
C62  53.16,25.68 180 bottom
C74  28.3,39.83 180 bottom
C75  28.3,35.81 180 bottom
C76  21.13,35.84 0 bottom
C77  21.13,39.83 0 bottom
C78  26.39,5.82 270 bottom
C79  22.4,5.82 270 bottom
C80  18.39,5.79 270 bottom
C81  14.38,5.79 270 bottom
D4  28.78,24.59 0 bottom
H1  0,0 0 top
J1  61.4,40 180 bottom
J2  78.8,60.6 270 bottom
J3  81,31.8 90 bottom
J4  80.8,16.35 90 bottom
J5  11.2,74.8 90 top
J6  11.4,62.4 90 top
J7  11.4,48 90 top
J8  62.6,7.2 180 top
J9  75.2,7.2 180 top
L1  24,32 90 top
L6  47.73,29.01 90 bottom
M1  13.97,36.45 90 bottom
M2  8.99,27.79 270 bottom
M3  8.99,22.33 270 bottom
M4  8.99,15.29 270 bottom
R1  8.89,83.44 90 top
R2  7.87,32.61 90 bottom
R3  10.29,32.61 270 bottom
R4  16.18,11.58 90 bottom
R5  13.82,16.59 90 bottom
R6  23.85,16.56 270 bottom
R7  15.29,32.64 90 bottom
R8  29.59,20.5 0 bottom
R9  18.8,11.56 270 bottom
R10  21.49,11.56 90 bottom
R11  330m  [0805]  64.02,27.19 90 top
R12  330m  [0805]  71.97,30.84 90 top
R13  71.99,26.77 270 top
R14  330m  [0805]  75.95,27.18 90 top
R15  330m  [0805]  83.92,30.82 90 top
R16  83.91,26.76 270 top
R32  18.8,16.56 270 bottom
R37  36.02,41.53 90 bottom
R38  32.77,41.5 90 bottom
R46  29.51,27.38 0 bottom
R47  29.51,29.79 0 bottom
R51  53.16,20.45 0 bottom
R52  40.77,23.14 0 bottom
R53  46.85,20.07 180 bottom
R54  40.77,18.52 180 bottom
U1  67.99,29.01 90 top
U2  79.93,28.9 90 top
U5  46.86,23.14 0 bottom
U11  41.4,39.73 0 bottom
U$2  22.45,28.22 270 bottom
X1  49.03,72 0 top
X2  49.03,72 0 top

### Tracks (layer width: path | path; a pad name or v marks a point on that pad's centre or on a via)
3V3_SW1  (via drill 0.35)
  Top 0.305: H1.2.19 38.12,86.98 38.12,80.48 39,79.6 63.55,79.6 66.8,76.35 v66.8,37.91
  Bottom 0.305: J3.1 77.7,33.3 76.2,31.8 72.91,31.8 v66.8,37.91
5V_SW2  (via drill 0.35)
  Top 0.305: H1.2.13 30.5,86.97 30.5,77.89 31.54,76.85 58.55,76.85 59.2,76.2 v59.2,34.8
  Bottom 0.305: J4.2 65.55,17.85 59.2,24.2 v59.2,34.8
5V_SW3  (via drill 0.35)
  Top 0.305: H1.2.15 33,87.02 33,78.6 33.9,77.7 60.3,77.7 61.8,76.2 v61.8,34.8
  Bottom 0.305: J4.1 67,18.85 61.74,24.11 61.74,34.74 v61.8,34.8
5V_SW4  (via drill 0.35)
  Top 0.305: H1.2.16 33.01,89.55 35.05,89.55 35.55,89.05 35.55,79.65 36.6,78.6 61.64,78.6 64.29,75.95 64.29,37.61 v64.7,37.2
  Bottom 0.305: J3.2 77.9,32.3 76.6,31 70.9,31 v64.7,37.2
5V_VCC
  Bottom 0.305: H1.1.18 33.02,84.45 33.02,79.73 34.15,78.6 79.2,78.6 83.68,74.12 83.68,67.08 79.2,62.6 J2.1 73.6,62.6 59.4,48.4 J1.1
12V_SW1  (via drill 0.35)
  Top 0.61: v50.01,19.43 50.01,23.72 48.31,25.43 v41.3,25.43
  Bottom 0.305: 42.29,30.18 C55.1 42.21,30.09 42.12,30.18 40.87,30.18 | 47.76,20.05 R53.2 | 39.87,23.86 39.87,23.99 39.87,29.17
  Bottom 0.61: 39.87,23.86 R52.2 39.87,29.17 40.87,30.18 40.88,30.19 42.31,30.19 | 39.87,23.99 v41.3,25.43 | C55.1 42.31,30.19 | 42.31,30.19 L6.2 | 48.9,17.8 C56.1 52.26,17.11 53.17,16.2 76.1,16.2 76.75,16.85 J4.3 | 48.9,17.8 C54.2 47.76,20.05 | v50.01,19.43 50.01,18.92 48.9,17.8
+3V3_BUS  (via drill 0.35)
  Top 0.305: R13.2 72,25.85 | R16.2
  Top 0.406: R13.2 71.99,24.61 v72,24.6 | R16.2 83.85,25.81 v83.85,24.6
  Top 0.61: H1.2.28 H1.2.27
  Route2 0.406: v83.85,24.6 83.05,23.8 75.6,23.8 | 75.6,23.8 72.8,23.8 v72,24.6 | 75.6,23.8 v75.6,29.8
  Route15 0.406: v75.6,29.8 85.8,40 85.8,72 79.2,78.6 50,78.6 48.25,80.35 48.25,87 H1.2.27
+3V3_VCC  (via drill 0.35)
  Top 0.305: v23.8,67.8 24.64,68.64 X1.1
  Bottom 0.305: U11.8 38.62,43.04 39.37,43.79 C57.1 | 38.61,41.59 U11.8 | U11.8 37.77,42.43 R37.2 35.99,42.4 R38.2 26.79,42.4 23.8,45.39 v23.8,67.8
+5V_BUS  (via drill 0.35)
  Top 0.305: C20.2 80.25,36.1 U2.12 | C14.2 70.45,38 67.8,35.35 67.8,33.9 68.32,33.38 U1.12
  Top 0.406: H1.2.25 44.45,88.25 | C14.2 C18.2 74.35,38.1 | 74.35,38.1 C19.2 C20.2 | C20.2 | 74.35,38.1 74.35,44.25 71.8,46.8 v71.8,51.4
  Top 0.61: H1.2.26 H1.2.25
  Route15 0.406: v71.8,51.4 71.8,74.6 69.4,77 47.2,77 45.75,78.45 45.75,86.97 H1.2.25
BST_3V3_BUS
  Bottom 0.305: U5.1 49.05,24.84 49.89,25.68 C62.1
D+
  Bottom 0.305: H1.1.19 36.87,83.22 38.43,81.66 82.62,81.66 87,77.28 87,66 | 87,66 | J1.4 62.4,46 76,59.6 J2.4 81.4,59.6 87,65.2 87,66
D-
  Bottom 0.305: H1.1.20 35.56,84.45 35.56,81.98 37,80.54 81.73,80.54 85.91,76.36 85.91,65.71 80.8,60.6 J2.3 75.2,60.6 61.4,46.8 J1.3
FB_3V3_BUS
  Bottom 0.305: U5.6 44.68,21.34 R53.1 C54.1 45.25,18.52 R54.2
GND  (via drill 0.2 pad 0.41, 0.2 pad 0.51, 0.25 pad 0.3, 0.25 pad 0.64, 0.25 pad 0.76, 0.35, 0.35 pad 0.74)  (204 unrouted)
  other vias: 73.14,67.13 55.44,67.08 57.91,67.13 60.45,67.13 62.99,67.16 65.55,67.16 68.07,67.16 70.64,67.16 45.13,67.01 16.13,25.81 25.37,77.19 28.47,76.43 16.13,24.89 16.13,24 17.04,24 17.04,24.89 17.04,25.81 17.98,25.81 17.98,24 18.9,24 18.9,24.89 18.9,25.81 19.84,25.81 19.84,24.89 19.84,24 46.38,22.43 46.38,23.14 47.35,23.14 47.35,22.43 27.44,72 29.99,72 32.53,72 46.38,23.85 47.35,23.85 88.52,61.01 88.52,63.04 88.52,64.06 88.52,65.07 88.52,66.09 88.52,67.11 88.52,68.12 88.52,62.03 88.52,77.22 88.52,79.25 88.52,80.26 88.52,81.28 88.52,82.3 88.52,83.31 88.52,84.33 88.52,78.23 88.52,44.81 88.52,46.84 88.52,47.85 88.52,48.87 88.52,49.89 88.52,50.9 88.52,51.92 88.52,45.82 88.52,11.51 88.52,13.54 88.52,14.55 88.52,15.57 88.52,16.59 88.52,17.6 88.52,18.62 88.52,12.52 32.72,1.73 30.68,1.73 29.67,1.73 28.65,1.73 27.64,1.73 26.62,1.73 25.6,1.73 31.7,1.73 16.51,1.73 14.48,1.73 13.46,1.73 12.45,1.73 11.43,1.73 10.41,1.73 9.4,1.73 15.49,1.73 67.11,1.75 65.07,1.75 64.06,1.75 63.04,1.75 62.03,1.75 61.01,1.75 59.99,1.75 66.09,1.75 80.7,1.73 78.66,1.73 77.65,1.73 76.63,1.73 75.62,1.73 74.6,1.73 73.58,1.73 79.68,1.73 4.19,62.28 4.19,64.31 4.19,65.33 4.19,66.34 4.19,67.36 4.19,68.38 4.19,69.39 4.19,63.3 4.19,78.49 4.19,80.52 4.19,81.53 4.19,82.55 4.19,83.57 4.19,84.58 4.19,85.6 4.19,79.5 4.06,17.25 4.06,19.28 4.06,20.29 4.06,21.31 4.06,22.33 4.06,23.34 4.06,24.36 4.06,18.26 4.19,46.08 4.19,48.11 4.19,49.12 4.19,50.14 4.19,51.16 4.19,52.17 4.19,53.19 4.19,47.09
  pour Top: -7.37,100.71 -7.37,-4.7 94.49,-4.7 94.49,100.71
  pour Bottom: -8.76,101.35 -8.76,-8.38 98.04,-8.38 98.04,101.35
GND2  (via drill 2.25 pad 4)
  other vias: 53.4,34.25
GPIO17
  Top 0.305: J6.1 36.37,64.9 37.6,66.13 X1.11
GPIO22
  Top 0.305: J6.4 40.95,61.9 42.68,63.63 X1.15
GPIO23
  Top 0.305: J6.3 39.9,62.9 41.4,64.4 41.4,74.07 X1.16
GPIO24
  Top 0.305: J6.5 41.95,60.9 44,62.95 44,74.13 X1.18
GPIO25
  Top 0.305: J6.6 42.9,59.9 46.5,63.5 46.5,71.5 47,72 48.6,72 49,72.4 49,74.05 X1.22
GPIO27
  Top 0.305: J6.2 38.81,63.9 40.14,65.23 X1.13
GPIO_FAULT1  (via drill 0.35)
  Top 0.305: v82.4,46.8 82.4,72.9 77.7,77.6 70.4,77.6 66.4,81.6 64.4,81.6 63.5,82.5 63.5,84.45 H1.1.40 | U1.8 70.46,26.14 R13.1 73.4,29.08 v73.4,33.8
  Route15 0.305: v73.4,33.8 73.4,37.8 v82.4,46.8
GPIO_FAULT2
  Top 0.305: H1.1.46 70.47,85.72 70.8,85.4 70.8,85.35 71.67,84.48 72.91,84.48 73.66,83.73 73.66,81.89 75,80.55 81.75,80.55 85.9,76.4 85.9,29.66 R16.1 83.83,27.66 U2.8
GPIO_SLEEP1  (via drill 0.35)
  Top 0.305: H1.1.42 66.02,84.48 67.84,84.48 68.6,83.72 68.6,81 71,78.6 79.2,78.6 83.7,74.1 83.7,45.9 v82,44.2 | U1.1 65.72,25.92 v63.27,23.47
  Route15 0.305: v63.27,23.47 63.27,21.73 66.8,18.2 70.4,18.2 74.4,22.2 74.4,36.6 v82,44.2
GPIO_SLEEP2  (via drill 0.35)
  Top 0.305: H1.1.48 73.08,85.72 74.33,84.47 75.48,84.47 76.2,83.75 76.2,82.45 77,81.65 82.65,81.65 87,77.3 v87,63.6 | U2.1 76.62,25 v76.6,25
  Route15 0.305: v76.6,25 76.6,22.8 78.8,20.6 85.8,20.6 87,21.8 v87,63.6
GPIO_TRQ1  (via drill 0.35)
  Top 0.305: H1.1.38 60.95,84.47 60.95,81.55 61.95,80.55 65.85,80.55 69.6,76.8 71.2,76.8 71.9,76.1 71.9,66.2 68.97,63.27 69,63.23 v69,38 | U1.11 68.97,34.37 v69,34.4
  Route2 0.305: v69,34.4 v69,38
GPIO_TRQ2
  Top 0.305: H1.1.44 67.78,85.72 69.03,84.47 70.38,84.47 71.13,83.72 71.13,80.87 72.4,79.6 80.6,79.6 84.8,75.4 84.8,44.8 80.91,40.91 U2.11
ID
  Bottom 0.305: H1.1.17 34.29,81.71 36.4,79.6 80.6,79.6 84.8,75.4 84.8,66.4 80,61.6 J2.2 74.4,61.6 60.4,47.6 J1.2
IN1  (via drill 0.35)
  Top 0.305: U1.16 65.72,32.68 v63.2,35.2
  Route2 0.305: v63.2,35.2 63.2,42.8 36.4,69.6 36.4,77.8 40.65,82.05 40.65,84.47 H1.1.24
IN2  (via drill 0.35)
  Top 0.305: U1.15 66.37,34.64 v65.81,35.2
  Route2 0.305: v65.81,35.2 65.81,42.59 38.85,69.55 38.85,78.9 41.91,81.96 H1.1.23
IN3  (via drill 0.35)
  Top 0.305: U1.9 70.27,32.87 v72.4,35
  Route2 0.305: v72.4,35 72.4,41.2 44,69.6 44,82.77 H1.1.25
IN4  (via drill 0.35)
  Top 0.305: U1.10 69.62,33.62 v71,35
  Route2 0.305: v71,35 71,40 41.4,69.6 41.4,80.1 43.2,81.9 43.2,84.47 H1.1.26
IN5  (via drill 0.35)
  Top 0.305: U2.16 76,33.43 v76,34
  Route2 0.305: v76,34 76,40 46.5,69.5 46.5,76.7 45.8,77.4 45.8,84.53 H1.1.28
IN6  (via drill 0.35)
  Top 0.305: U2.15 78.21,31.87 78.21,32.67 77.5,33.39 v77.5,36.5
  Route2 0.305: H1.1.27 47.01,83.21 47.01,78.8 49,76.8 49,69.6 77.5,41.1 v77.5,36.5
IN7  (via drill 0.35)
  Top 0.305: U2.9 82.2,32.01 v84.8,34.6
  Route2 0.305: v84.8,34.6 84.8,49.6 80.8,53.6 70.1,53.6 54.1,69.6 54.1,78.65 H1.1.29
IN8  (via drill 0.35)
  Top 0.305: U2.10 81.56,33.16 v82.2,33.8
  Route2 0.305: v82.2,33.8 82.2,39 51.6,69.6 51.6,78.8 48.25,82.15 48.25,84.44 H1.1.30
N$1  (via drill 2.25 pad 4)
  other vias: 38.9,34.25
N$2  (via drill 0.35)
  other vias: 88.6,32.6
N$3  (via drill 2.25 pad 4)
  other vias: 38.9,13.22
N$4  (via drill 2.25 pad 4)
  other vias: 53.4,13.25
N$5  (via drill 2.8 pad 6)
  other vias: 20.03,49
N$6  (via drill 2.8 pad 6)
  other vias: 20.03,72
N$7  (via drill 2.8 pad 6)
  other vias: 78.03,49
N$8  (via drill 2.8 pad 6)
  other vias: 78.03,72
N$9
  Top 0.813: R1.2 H1.P$4
N$10
  Bottom 0.305: M1.P$4 M1.P$3 | M1.P$3 M1.P$2 | C3.1 13.34,33.51 | 13.34,33.51 13.98,32.87 13.98,29.92 15.05,28.85 U$2.P$3 15.05,26.86 15.21,26.7 | 13.34,33.51 13.31,33.54 R7.2 15.98,34.23 M1.P$3 | 15.21,26.7 16.18,26.7 16.35,26.86 U$2.P$5 | M2.P$5 M2.P$6 | M2.P$6 M2.P$7 M2.P$8 9.68,24.61 11.76,26.7 15.21,26.7 | M2.P$6 7.01,25.43 M2.P$9
N$11
  Bottom 0.305: C3.2 12.7,30.02 14.43,28.3 14.43,27.67 U$2.P$2
N$12
  Bottom 0.305: C6.1 21.54,19.63 20.82,20.34 20.26,20.91 20.25,20.92 U$2.P$25
N$13
  Bottom 0.305: R5.2 13.82,18.44 14.94,19.56 17.17,19.56 18.29,20.68 18.29,22.18 U$2.P$22
N$14  (via drill 0.35)
  Top 0.305: L1.P$2 9.15,35 7.67,33.53 v7.67,16.13
  Bottom 0.305: M4.P$4 M4.P$3 M4.P$2 v7.67,16.13 7.67,17.41 | M3.P$8 M3.P$7 | M3.P$7 M3.P$6 M3.P$5 | M3.P$7 7.7,19.96 M3.P$9 | U$2.P$17 15.05,21.48 14.73,21.16 13.13,21.16 12.55,20.57 12.55,15.98 12.26,15.69 C10.1 9.39,15.69 7.67,17.41 | 7.67,17.41 M3.P$7
N$15
  Bottom 0.305: R32.2 R9.1
N$16
  Top 0.305: U1.6 68.97,26.97 69.3,27.3 70.25,27.3 70.95,28 70.95,31.18 71.52,31.74 R12.2
N$17
  Bottom 0.305: M2.P$1 13.73,27.66 U$2.P$1
N$18
  Top 0.305: R11.2 64.71,27.4 66.56,27.4 67.02,26.95 U1.3
N$20
  Top 0.305: U2.6 80.91,26.91 81.2,27.2 82.2,27.2 82.88,27.88 82.88,30.98 83.62,31.73 R15.2
N$21
  Top 0.305: R14.2 76.8,27.23 78.57,27.23 78.95,26.84 U2.3
N$34  (via drill 0.35)
  Top 0.305: v15.7,30.4 15.7,34.59 v14.63,35.66
  Bottom 0.305: M1.P$1 v14.63,35.66 | U$2.P$4 v15.7,30.4
N$35
  Bottom 0.305: M3.P$1 8.36,22.19 U$2.P$15
N$36  (via drill 0.35)
  Top 0.305: v19.43,29.21 18.95,29.69 10.92,29.69 v10.29,30.33
  Bottom 0.305: U$2.P$9 18.95,28.3 19.43,28.78 v19.43,29.21 | v10.29,30.33 R3.2
  Bottom 0.61: R2.1 R3.2
N$39
  Bottom 0.305: U$2.P$13 U$2.P$12 | U$2.P$12 U$2.P$11 | C5.1 U$2.P$12
N$41
  Bottom 0.305: U$2.P$23 18.95,19.96 17.48,18.49 17.48,16.99 | R4.2 16.98,12.48 17.48,12.98 17.48,16.99 | C7.1 16.98,17.49 17.48,16.99
N$43
  Bottom 0.305: R6.1 23.85,18.59 20.9,21.54 U$2.P$26
N$44  (via drill 0.35)
  Top 0.305: v18.67,30.53 23.85,30.53 25.45,28.93 v25.45,18.06
  Bottom 0.305: C8.1 R6.2 24.96,15.66 25.45,16.15 v25.45,18.06 | U$2.P$8 18.3,30.16 v18.67,30.53
N$45  (via drill 0.35)
  Top 0.305: L1.P$1 18.8,35 16.79,32.99 v16.79,31.09
  Bottom 0.305: R7.1 16.16,31.74 16.79,31.11 v16.79,31.09 16.79,28.5 17,28.29 U$2.P$6
N$47  (via drill 0.35)
  Top 0.305: v12.78,23.6 11.99,23.6 11.38,22.99 v11.38,21.06
  Bottom 0.305: U$2.P$16 14.4,23.04 13.84,23.6 v12.78,23.6 | C10.2 v11.38,21.06
N$48  (via drill 0.35)
  Top 0.305: v9.73,12.12 15.44,12.12 | v16.36,20.32 16.36,13.03 15.44,12.12 | 15.44,12.12 v29.74,12.12 | v26.57,26.29 v30.1,22.76
  Bottom 0.305: 30.5,18.18 C17.1 | M4.P$5 M4.P$6 | M4.P$6 M4.P$7 | M4.P$7 M4.P$8 v9.73,12.12 9.53,12.12 | M4.P$7 7.67,12.93 M4.P$9 7.01,12.93 M4.P$6 | v16.36,20.32 U$2.P$19 | C9.1 30.5,13.57 | C17.1 C12.1 C9.1 | C17.1 30.49,18.19 R8.1 30.49,22.37 v30.1,22.76 | C9.1 30.52,12.89 v29.74,12.12 | 22.53,29.54 22.53,27.98 U$2.P$14 25.21,27.64 v26.57,26.29
  Bottom 0.61: C75.1 C74.1 | 22.53,29.54 C76.1 C77.1 | C77.1 22.56,39.85 | C77.1 C74.1 | C74.1 26.92,39.85
N$49  (via drill 0.35)
  Top 0.305: v9.86,14.55 11.96,14.55 13.46,16.05 13.46,19.74 14.1,20.37 v14.12,20.37
  Bottom 0.305: v9.86,14.55 8.94,14.55 M4.P$1 | U$2.P$18 15.7,21.21 14.86,20.37 v14.12,20.37
N$51
  Bottom 0.305: R10.2 21.48,12.45 20.6,12.45 20.17,12.88 20.17,16.97 19.67,17.46 R32.1 18.8,18.44 19.6,19.24 U$2.P$24
N$55
  Bottom 0.305: C11.1 R4.1
PG_3V3_BUS
  Bottom 0.305: R52.1 U5.8
RPI_GND
  Bottom 0.305: J1.5 63.4,45.46 J2.5
RT_3V3_BUS
  Bottom 0.305: U5.4 50.07,22.64 R51.2
SCL1_I2C
  Top 0.305: J5.2 14.5,74.3 15,73.8 15,69 18.05,65.95 28.65,65.95 29.98,67.28 X1.5
SDA1_I2C
  Top 0.305: J5.1 14.9,75.3 16,74.2 16,69.4 18.4,67 26.19,67 27.44,68.25 X1.3
SPI0_CE0_N
  Top 0.305: J7.3 14.9,48.5 18.4,45 34.1,45 51.6,62.5 51.6,73.8 51.6,73.86 51.6,74.11 X1.24
SPI0_CE1_N
  Top 0.305: J7.5 13.87,46.4 14.2,46.4 17.7,42.9 35.5,42.9 54.1,61.5 54.1,74.07 X1.26
SPI0_CS  (via drill 0.35)
  Top 0.406: v29.34,78.82 26.31,78.82 25.4,79.73 v25.4,80.92
  Bottom 0.305: U11.4 46.43,37.77 48.54,39.88 48.54,52.58 44.83,56.29 35.48,56.29 33.78,57.99 33.78,76.96 31.93,78.82 v29.34,78.82
  Bottom 0.406: v25.4,80.92 25.4,84.45 H1.1.10
SPI0_MISO  (1 unrouted)
  Top 0.305: J7.2 14.5,49.5 22.8,57.8 45.05,57.8 50.3,63.05 50.3,68.9
SPI0_MOSI  (1 unrouted)
  Top 0.305: J7.1 22.17,58.9 43.95,58.9 47.75,62.7 47.75,68.9
SPI0_SCLK  (1 unrouted)
  Top 0.305: J7.4 14.5,47.5 18.1,43.9 30.2,43.9 30.5,43.9 34.9,43.9 52.84,61.84 52.84,68.9
SPI1_D0
  Bottom 0.305: U11.2 44.96,40.31 45.67,41.02 45.67,51.23 43.18,53.72 31.09,53.72 28.68,56.13 28.68,74.45 26.67,76.45
  Bottom 0.406: 26.67,76.45 H1.1.11
SPI1_D1
  Bottom 0.305: U11.3 45.65,39.04 46.97,40.36 46.97,52.15 44.25,54.86 33.35,54.86 31.22,57 31.22,74.99
  Bottom 0.406: H1.1.12 27.94,84.45 27.94,78.27 31.22,74.99
SPI1_SCLK
  Bottom 0.305: H1.1.9 24.13,76.45 26.16,74.42 26.16,55.19 28.82,52.54 42.2,52.54 44.08,50.66 U11.1
SW_3V3_BUS
  Bottom 0.305: U5.2 50.06,23.64 50.83,24.41 53.62,24.41 54.06,24.85 C62.2 54.06,26.71 52.95,27.82 L6.1
TORQUE_1A
  Top 0.305: U1.2 66.37,24.97 61.1,19.7 J8.1
TORQUE_1B
  Top 0.305: U1.4 67.67,24.87 62.1,19.3 J8.2
TORQUE_2A
  Top 0.305: U1.7 69.62,23.92 64.1,18.4 J8.4
TORQUE_2B
  Top 0.305: 68.34,26.11 U1.5 68.32,24.02 63.1,18.8 J8.3
TORQUE_3A
  Top 0.305: U2.2 78.31,24.5 73.7,19.9 J9.1
TORQUE_3B
  Top 0.305: U2.4 79.61,24.55 74.7,19.65 J9.2
TORQUE_4A
  Top 0.305: U2.7 81.56,23.55 76.65,18.65 76.65,9.69 J9.4
TORQUE_4B
  Top 0.305: U2.5 80.25,23.75 75.7,19.2 J9.3
TRSS_3V3_BUS
  Bottom 0.305: C52.1 43.48,22.64 U5.7
U11_CT
  Bottom 0.305: U11.6 36.58,39.04 36.02,39.6 R37.1
U11_INT
  Bottom 0.305: R38.1 32.79,40.58 32.77,40.55 32.77,39.52 34.52,37.77 U11.5
V_BATT
  Bottom 0.305: M1.P$5 M1.P$6 | M1.P$6 M1.P$7 M1.P$8 | M1.P$6 15.95,38.81 M1.P$9 | U$2.P$7 17.65,28.91 17.65,29.69
  Bottom 0.406: 21.05,89.56 21.2,89.56 | 68.58,89.56 21.2,89.56 | 21.2,89.56 21.15,89.51 21.07,89.51 20.34,88.78 20.34,82.4 20.34,82.2
  Bottom 0.61: R2.2 C16.1 5.41,38.38 5.44,38.41 | C15.1 5.44,38.41 | 5.44,38.41 C4.1 C2.1 C1.1 15.54,38.41 M1.P$9 16.89,38.48 17.65,37.72 | 17.65,28.91 17.65,37.72 | 17.65,37.72 17.65,41.23 15.24,43.64 15.24,75.15 16.69,76.6 18.8,76.6 20.34,78.14 20.34,82.4 | H1.2.45 68.58,89.56 69.83,90.81 H1.2.46
V_BATT_SENSE
  Bottom 0.61: R47.2 R46.2
VCC  (via drill 0.35)  (1 unrouted)
  Top 0.61: v43.08,24.16 v37.39,24.16
  Bottom 0.305: U5.9 43.59,23.64 v43.08,24.16
  Bottom 0.61: C81.1 C80.1 | C80.1 18.41,7.22 | C80.1 22.38,7.19 C79.1 C78.1 | 23.37,22.2 26.42,19.15 26.42,11 | 26.42,11 24.61,9.2 19.74,9.2 18.8,10.13 R9.2 | 23.36,22.2 23.37,22.2 | 23.36,22.2 25.74,24.59 D4.A D4.C R46.1 | 26.42,11 26.42,7.24 C78.1 | R8.2 26.99,22.2 23.37,22.2 | C78.1 31.55,7.22 | 31.55,7.22 34.92,10.59 34.92,21.69 v37.39,24.16 | C13.1 31.55,7.22 | 23.36,22.2 23.35,22.19 22.29,22.19
VCC_3V3_BUS
  Bottom 0.305: U5.3 C53.1

### Text on the board
tPlace: Raspberry Pi Zero | RPI Zero Camera
tNames: PayLoad Board Rev. 1.0 / SN: ______________